# EAGLE design TrinketBlinkM0L (EAGLE 8.4.3)
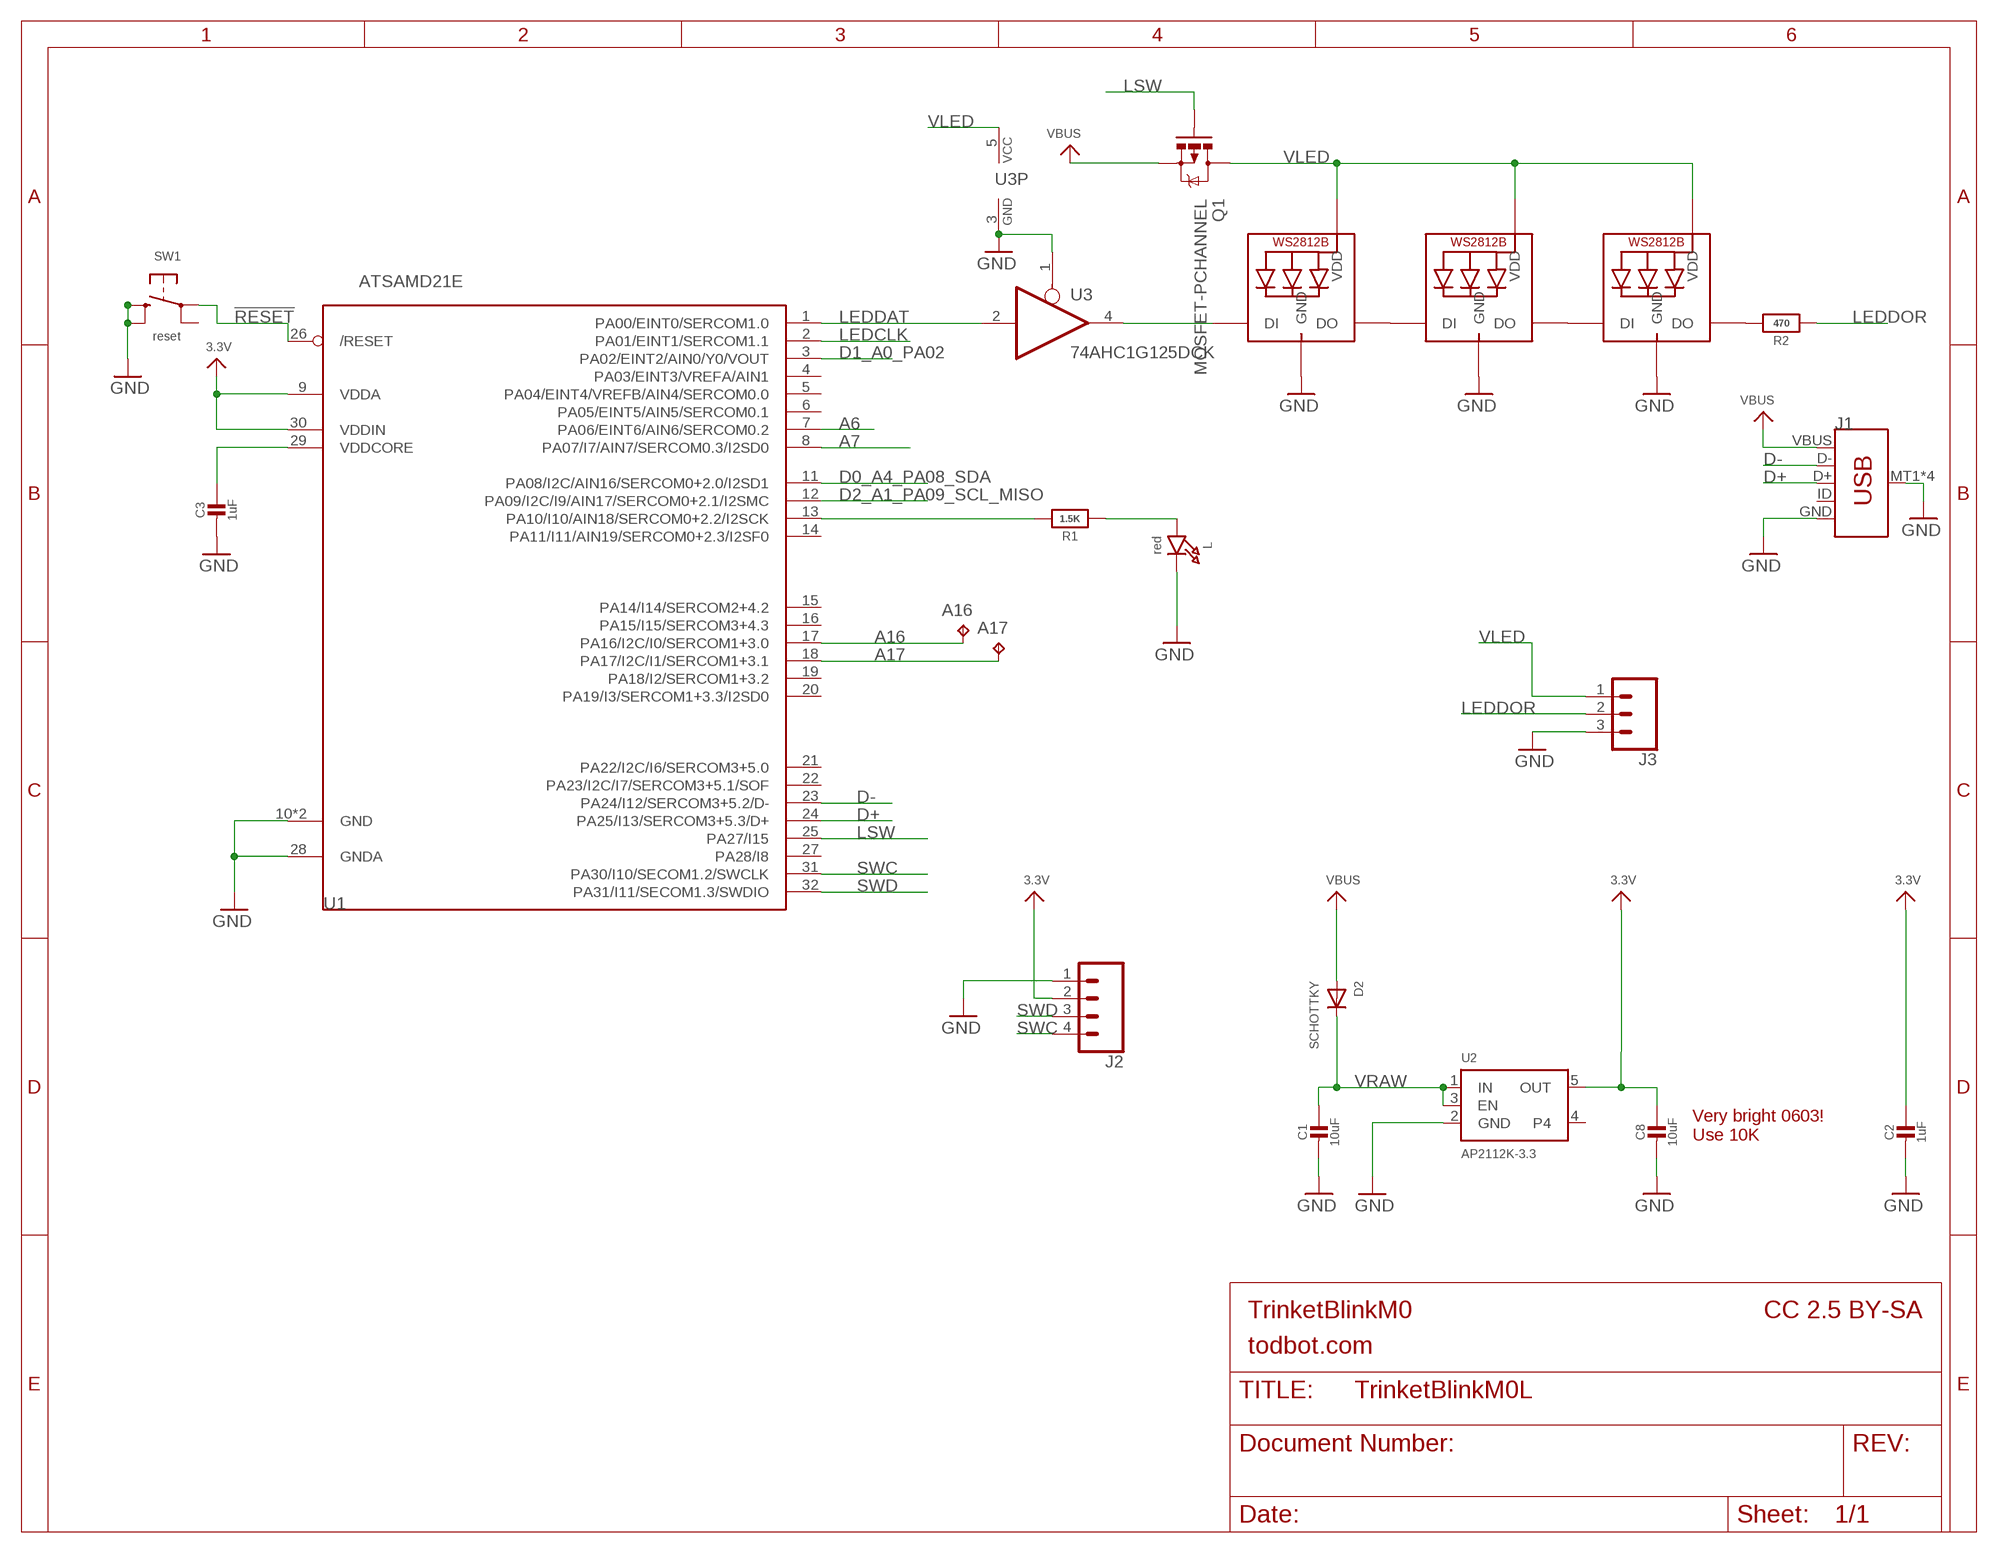
[diagram p0: schematic, sheet 1]

## Parts
A16  TPB1,27  [B1,27]
A17  TPB1,27  [B1,27]
C1  10uF  CAP_CERAMIC0805-NOOUTLINE  [0805-NO]
C2  1uF  CAP_CERAMIC0603_NO  [0603-NO]
C3  1uF  CAP_CERAMIC0603_NO  [0603-NO]
C8  10uF  CAP_CERAMIC0805-NOOUTLINE  [0805-NO]
D2  SCHOTTKY  DIODE_SOD-123FL  [SOD-123FL]
J1  USB_MICRO-B_SMT  [USB-MICROB]
J2  CONN_04  [1X04]
J3  CONN_03  [1X03]
L  red  LED0603_NOOUTLINE  [CHIPLED_0603_NOOUTLINE]
LED1  WS2812B3535  [LED3535]
LED2  WS2812B3535  [LED3535]
LED3  WS2812B3535  [LED3535]
Q1  MOSFET-PCHANNEL  [SOT23-3]
R1  1.5K  RESISTOR_0603_NOOUT  [0603-NO]
R2  470  RESISTOR_0603_NOOUT  [0603-NO]
SW1  reset  SWITCH_TACT_SMT4.6X2.8  [BTN_KMR2_4.6X2.8]
U1  ATSAMD21E  [QFN32_5MM]
U2  AP2112K-3.3  VREG_SOT23-5  [SOT23-5]
U3  74AHC1G125DCK  [SC70-5]

## Nets
3.3V: C2.1 C8.1 J2.2 U1.9(VDDA) U1.30(VDDIN) U2.5(OUT)
!RESET: SW1.A(P) U1.26(/RESET)
A6: U1.7(PA06/EINT6/AIN6/SERCOM0.2)
A7: U1.8(PA07/I7/AIN7/SERCOM0.3/I2SD0)
A16: A16.TP U1.17(PA16/I2C/I0/SERCOM1+3.0)
A17: A17.TP U1.18(PA17/I2C/I1/SERCOM1+3.1)
D0_A4_PA08_SDA: U1.11(PA08/I2C/AIN16/SERCOM0+2.0/I2SD1)
D1_A0_PA02: U1.3(PA02/EINT2/AIN0/Y0/VOUT)
D2_A1_PA09_SCL_MISO: U1.12(PA09/I2C/I9/AIN17/SERCOM0+2.1/I2SMC)
D+: J1.D+ U1.24(PA25/I13/SERCOM3+5.3/D+)
D-: J1.D- U1.23(PA24/I12/SERCOM3+5.2/D-)
GND: C1.2 C2.2 C3.2 C8.2 J1.GND J1.MT1(SHIELD) J1.MT2(SHIELD) J1.P$1(SHIELD) J1.P$2(SHIELD) J2.1 J3.3 L.C LED1.4(GND) LED2.4(GND) LED3.4(GND) SW1.B'(S1) SW1.B(S) U1.10(GND) U1.28(GNDA) U1.33(GND) U2.2(GND) U3.1(OE) U3.3(GND)
LEDCLK: U1.2(PA01/EINT1/SERCOM1.1)
LEDDAT: U1.1(PA00/EINT0/SERCOM1.0) U3.2(I)
LEDDATO: LED1.1(DI) U3.4(O)
LEDDOR: J3.2 R2.1
LSW: Q1.1(G) U1.25(PA27/I15)
N$1: L.A R1.1
N$2: R1.2 U1.13(PA10/I10/AIN18/SERCOM0+2.2/I2SCK)
N$4: LED1.3(DO) LED2.1(DI)
N$5: LED2.3(DO) LED3.1(DI)
N$6: LED3.3(DO) R2.2
SWC: J2.4 U1.31(PA30/I10/SECOM1.2/SWCLK)
SWD: J2.3 U1.32(PA31/I11/SECOM1.3/SWDIO)
VBUS: D2.A J1.VBUS Q1.2(S)
VDDCORE: C3.1 U1.29(VDDCORE)
VLED: J3.1 LED1.2(VDD) LED2.2(VDD) LED3.2(VDD) Q1.3(D) U3.5(VCC)
VRAW: C1.1 D2.C U2.1(IN) U2.3(EN)
Unconnected: J1.ID SW1.A'(P1) U1.4(PA03/EINT3/VREFA/AIN1) U1.5(PA04/EINT4/VREFB/AIN4/SERCOM0.0) U1.6(PA05/EINT5/AIN5/SERCOM0.1) U1.14(PA11/I11/AIN19/SERCOM0+2.3/I2SF0) U1.15(PA14/I14/SERCOM2+4.2) U1.16(PA15/I15/SERCOM3+4.3) U1.19(PA18/I2/SERCOM1+3.2) U1.20(PA19/I3/SERCOM1+3.3/I2SD0) U1.21(PA22/I2C/I6/SERCOM3+5.0) U1.22(PA23/I2C/I7/SERCOM3+5.1/SOF) U1.27(PA28/I8) U2.4

## Notes on the sheet
- Very bright 0603!
  Use 10K
- TrinketBlinkM0 | CC 2.5 BY-SA
- todbot.com

## Library data of the parts
A16 A17 = testpad:TP: Test pad
C1-C3 C8 = microbuilder:CAP_CERAMIC: Ceramic Capacitors For new designs, use the packages preceded by an '_' character since they are more reliable: The following footprints should be used on most boards: _0402 - Standard footprint for regular board layouts _0603 - Standard footprint for regular board layouts _0805 - Standard footprint for regular board layouts _1206 - Standard footprint for regular board layouts For extremely tight-pitch boards where space is at a premium, the following 'micro-pitch' footprints can be used (smaller pads, no silkscreen outline, etc.): _0402MP - Micro-pitch footprint for very dense/compact boards _0603MP - Micro-pitch footprint for very dense/compact boards _0805MP - Micro-pitch footprint for very dense/compact boards _1206MP - Micro-pitch footprint for very dense/compact boards
D2 = adafruit:DIODE: Diode SMADIODE - SMA Surface Mount Package 20V 1A Schottky Diode Digikey: 641-1014-6-ND DO-1N4148 - Through Hole Small Current Diode SOD-123 20V 1 A (.5mV Vf) Schottky Diode - Digikey: MBRX120TPMSCT-ND SOD-323 10V 570mA (.38mV Vf, 3ns) Schottky Diode - Digikey: ZLLS410CT-ND SOD-523 30V 30mA Schottky Diode (RB751S-40TE61) - Digikey: RB751S-40TE61CT-ND SOT23-R/W - SOT23 Package (R = Solder Paste/Reflow Ovens, W = Hand-Soldering) BAT54Film 40V 300mA - Digikey: 497-7162-1-ND
J1 = SparkFun-Connectors:USB_MICRO-B: USB Type Micro-B Connector Male/female and PTH/SMT variants SparkFun Products: SparkFun microB USB Breakout <https://www.sparkfun.com/products/12035> SparkFun USB microB Plug Breakout <https://www.sparkfun.com/products/10031> SparkFun ESP8266 Thing <https://www.sparkfun.com/products/13231>; PROD_ID: CONN-09505; SF_ID: PRT-08533
J2 = SparkFun-Connectors:CONN_04: Multi connection point. Often used as Generic Header-pin footprint for 0.1 inch spaced/style header connections On any of the 0.1 inch spaced packages, you can populate with these: Break Away Headers - Straight <https://www.sparkfun.com/products/116> (PRT-00116) Break Away Male Headers - Right Angle <https://www.sparkfun.com/products/553> (PRT-00553) Female Headers <https://www.sparkfun.com/products/115> (PRT-00115) Break Away Headers - Machine Pin <https://www.sparkfun.com/products/117> (PRT-00117) Break Away Female Headers - Swiss Machine Pin <https://www.sparkfun.com/products/743> (PRT-00743) For SCREWTERMINALS and SPRING TERMINALS visit here: Screw Terimnals on SparkFun.com <https://www.sparkfun.com/search/results?term=Screw+Terminals> (5mm/3.5mm/2.54mm spacing) This device is also useful as a general connection point to wire up your design to another part of your project. Our various solder wires solder well into these plated through hole pads. Hook-Up Wire - Assortment (Stranded, 22 AWG) <https://www.sparkfun.com/products/11375> (PRT-11375) Hook-Up Wire - Assortment (Solid Core, 22 AWG) <https://www.sparkfun.com/products/11367> (PRT-11367) View the entire wire category on our website here <https://www.sparkfun.com/categories/141> Special notes: Molex polarized connector foot print use with SKU : PRT-08231 with associated crimp pins and housings. 1MM SMD Version SKU: PRT-10208; PROD_ID: CONN-09696
J3 = SparkFun-Connectors:CONN_03: Multi connection point. Often used as Generic Header-pin footprint for 0.1 inch spaced/style header connections On any of the 0.1 inch spaced packages, you can populate with these: Break Away Headers - Straight <https://www.sparkfun.com/products/116> (PRT-00116) Break Away Male Headers - Right Angle <https://www.sparkfun.com/products/553> (PRT-00553) Female Headers <https://www.sparkfun.com/products/115> (PRT-00115) Break Away Headers - Machine Pin <https://www.sparkfun.com/products/117> (PRT-00117) Break Away Female Headers - Swiss Machine Pin <https://www.sparkfun.com/products/743> (PRT-00743) Stackable Header - 3 Pin (Female, 0.1") <https://www.sparkfun.com/products/13875> (PRT-13875) For SCREWTERMINALS and SPRING TERMINALS visit here: Screw Terimnals on SparkFun.com <https://www.sparkfun.com/search/results?term=Screw+Terminals> (5mm/3.5mm/2.54mm spacing) This device is also useful as a general connection point to wire up your design to another part of your project. Our various solder wires solder well into these plated through hole pads. Hook-Up Wire - Assortment (Stranded, 22 AWG) <https://www.sparkfun.com/products/11375> (PRT-11375) Hook-Up Wire - Assortment (Solid Core, 22 AWG) <https://www.sparkfun.com/products/11367> (PRT-11367) View the entire wire category on our website here <https://www.sparkfun.com/categories/141> Special notes: Molex polarized connector foot print use with SKU : PRT-08232 with associated crimp pins and housings.
L = microbuilder:LED: LED 0603 - 0603 Surface Mount Package 2mA: Green LED - Low Power (3.9mcd, 2ma, 1.7Vf) - Digikey: 475-2709-2-ND Orange LED - Low Power (9.8mcd, 2ma, 1.8Vf) - Digikey: 475-1194-2-ND Red LED - Low Power (5mcd, 2ma, 1.8Vf) - Digikey: 475-1195-2-ND Yellow LED - Low Power (7mcd, 2ma, 1.8Vf) - Digikey: 475-1196-2-ND 5mA: Blue LED - Low Power (17mcd, 5ma, 2.9Vf) - Digikey: LNJ937W8CRACT-ND 0805 - 0805 Surface Mount Package 2mA: Red LED (8.8mcd, 2mA, 1.8Vf, Clear) - Low Power [Digikey: 475-2510-1-ND] Green LED (5mcd, 2mA, 1.8Vf, Clear) - Low Power [Digikey: 475-2730-1-ND] Yellow LED (11.3mcd, 2mA, 1.8Vf, Clear) - Low Power [Digikey: 475-2555-1-ND] 20mA: Red LED (104mcd, 20mA, Diffused) - LS R976 [Digikey: 475-1278-6-ND] Red LED (12mcd, 20mA, 2.0Vf, Clear) - APT2012EC [Digikey: 754-1128-1-ND] Green LED (15mcd, 20mA, 2.2Vf, Clear) - APT2012GC [Digikey: 754-1131-1-ND] Orange LED (160mcd, 20mA, 2.1Vf, Clear) - APT2012SECK [Digikey: 754-1130-1-ND] 1206 - 1206 Surface Mount Package Green LED (26mcd, 20mA, Diffused) - LG N971 [Digikey: 475-1407-6-ND] Red LED (15mcd, 20mA, Diffused) - LH N974 [Digikey: 475-1416-6-ND] Cree - Cree High-Power Surface Mount LEDs XPEBWT-L1-0000-00D50 - White 111lm 350mA 2.9Vf 6200K 110° XTEAWT-00-0000-00000LEE3 - White 114lm 350mA 2.85Vf 5000K 115° Everlight - Everlight 45-21 Series Surface Mount LEDs 45-21/QK2C-B2832AC2CB2/2T - Warm White 2000mcd 20mA 3.25Vf 3050K 120° 45-21/LK2C-B38452C4CB2/2T - Nuetral White 2000mcd 20mA 3.25Vf 4150K 120° 45-21/LK2C-B50634C6CB2/2T - Cold White 2200mcd 20mA 3.25Vf 5650K 120° PLCC2 Reverse Mount LS T77K-J1L2-1-0-2-R18-Z - Red 11.25mcd 2mA 1.8Vf 630nm 120° LO T77K-L1M2-24-Z - Orange 19.6mcd 2mA 1.8Vf 606nm 120° LY T77K-K2M1-26-Z - Yellow 15.7mcd 2mA 1.8Vf 587nm 120°
LED1-LED3 = adafruit:WS2812B
Q1 = User-Submitted:MOSFET-PCHANNEL: Generic PMOSFET IRLML2244 - TRANS-11153 (SOT-23 -20V -4.3A) (1.Gate 2.Source 3.Drain) FQP27P06 - COM-10349 <http://www.sparkfun.com/products/10349> (TO-220 -60V -27A) (1.Gate 2.Source 3.Drain); PROD_ID: TRANS-08285
R1 R2 = microbuilder:RESISTOR: Resistors For new designs, use the packages preceded by an '_' character since they are more reliable: The following footprints should be used on most boards: _0402 - Standard footprint for regular board layouts _0603 - Standard footprint for regular board layouts _0805 - Standard footprint for regular board layouts _1206 - Standard footprint for regular board layouts For extremely tight-pitch boards where space is at a premium, the following 'micro-pitch' footprints can be used (smaller pads, no silkscreen outline, etc.): _0402MP - Micro-pitch footprint for very dense/compact boards _0603MP - Micro-pitch footprint for very dense/compact boards _0805MP - Micro-pitch footprint for very dense/compact boards _1206MP - Micro-pitch footprint for very dense/compact boards
SW1 = microbuilder:SWITCH_TACT_SMT: SMT Tact Switches 6x6mm - Digikey: P12940SCT-ND KMR2 (4.6x2.8mm) - Digikey: 401-1426-1-ND EVQ-PQHB55 - Light Touch, 160GF (4.5x4.5mm) - Digikey: P8090SCT-ND KMT0 - KMT021 NGJ LHS (etc.) IP68/Waterproof - Digikey: CKN10289CT-ND
U1 = microbuilder:ATSAMD21E
U2 = microbuilder:VREG_SOT23-5: SOT23-5 Fixed Voltage Regulators Part Current Out V Out V In V Dropout θJA (°C/W) TJ (°C) Digikey Part No. ADP121 150mA 3.3V 3.4-5.5V 0.09V @ 150mA -- -- ADP121-AUJZ33R7CT-ND ADP121 150mA 3.0V 3.1-5.5V 0.09V @ 150mA -- -- ADP121-AUJZ30R7CT-ND ADP122 300mA 3.3V 3.4-5.5V 0.085V @ 300mA -- -- ADP122AUJZ-3.3-R7CT-ND ADP1712 300mA 3.3V 3.5-5.5V 0.17V @ 300mA -- -- ADP1712AUJZ-3.3-R7TR-ND AP7311 (Low Cost) 150mA 3.3V 3.5-6V 0.15V @ 150mA -- -- AP7311-33WG-7DICT-ND LD39015M18R 150mA 1.8V 1.9V-5.5V 0.08V @ 100mA -- -- 497-6977-1-ND LP2985A-33DBVR 150mA 3.3V 3.3-16V 0.28V @ 150mA 206 150 296-18479-1-ND MCP1824T-3302E/OT 300mA 3.3V 3.5V-6V 0.2V @ 300mA -- -- MCP1824T-3302E/OTCT-ND MIC5205-2.5YM5 TR 150mA 2.5V 2.7-16V 0.165V @ 150mA -- -- 576-1257-2-ND MIC5205-3.0YM5 TR 150mA 3.0V 3.2V-16V 0.165V @ 150mA -- -- 576-1258-2-ND MIC5205-3.3YM5 TR 150mA 3.3V 3.5V-16V 0.165V @ 150mA -- -- 576-1259-2-ND TPS780330220 150mA 3.3V+2.2V 3.6-5.5V 250mV Max -- -- 296-23332-1-ND TDA3663/N1,135 100mA 3.3V 3.5-45V 0.18V @ 50mA -- -- 568-5343-1-ND Max operating temp can be calculated using θJA, TJ (max junction temperature), and power in watts. Set the "Maximum Ambient Temperature" until it reaches TJ ("Max Junction Temperature"), which is the absolute limit for safe use of the regulator: Heat Sink Temperature Calculator <http://www.daycounter.com/Calculators/Heat-Sink-Temperature-Calculator.phtml> For example, With 12V source into a 3.3V LP2985 and a 30mA load, we are dissipating (12V-3.3V) * 0.03A = 0.261W. With a θJA of 206 °C/W, a TJ of 150°C, and 261mW we can safely use the chip without a heat sink up to 75°C (=147.1°C Junction Temperature).
U3 = 74xx-little-us:74*1G125: Single Bus Buffer Gate with 3-State Output

## Net classes
1 power: width 0.305 mm

## Board
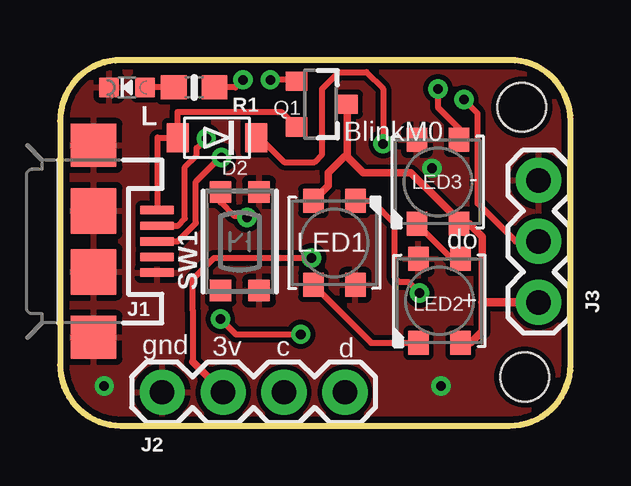
[diagram p1: board, top side]
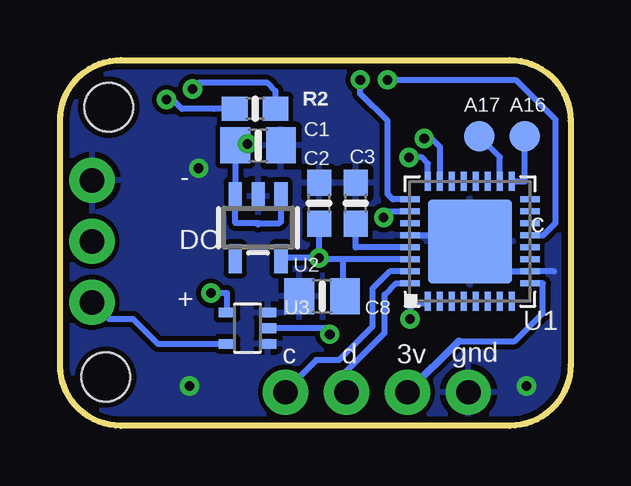
[diagram p2: board, bottom side, seen from below]

Size 21.27 x 15.24 mm. Coordinates in mm from the lower left corner, seen from the top.
Outline: 21.27,12.7 arc90 18.73,15.24 2.54,15.24 arc90 0,12.7 0,2.54 arc90 2.54,0 18.73,0 arc90 21.27,2.54 21.27,12.7
Copper layers (1*16): Top 0.035mm / dielectric 1.5mm / Bottom 0.035mm
Design rules "adafruit-2017": minimum track width 8mil, minimum drill 15.5mil, track to track 8mil, track to pad 8mil, pad to pad 8mil, via to via 8mil, smd to smd 8mil, copper to edge 10mil, drill to drill 8mil, minimum pad ring 10mil, minimum via ring 8mil, stop-mask expansion 2mil, vias tented up to drill 20mil, thermal gap 10mil
Holes 2.03 mm at 19.24,13.27 19.37,2.03

### Footprints (pad centres in the part's own frame; a part is rotated, then mirrored left to right if it is on the bottom)
B1,27 = smd 1.27 x 1.27: TP 0,0
0805-NO = smd 1.24 x 1.5: 1 -0.95,0; 2 0.95,0
0603-NO = smd 1.075 x 1: 1 -0.85,0; 2 0.85,0
SOD-123FL = smd 0.91 x 1.22: A 1.637,0; C -1.637,0
USB-MICROB = smd 1.4 x 0.35: D+ -2.65,0; D- -2.65,-0.65; GND -2.65,1.3; ID -2.65,0.65; VBUS -2.65,-1.3 | smd 1.9 x 1.8: MT1 0,-4; MT2 0,4 | smd 1.9 x 1.9: P$1 0,-1.27; P$2 0,1.27
1X04 = drill 1.016 pad 1.88: 1 0,0; 2 2.54,0; 3 5.08,0; 4 7.62,0
1X03 = drill 1.016 pad 1.88: 1 0,0; 2 2.54,0; 3 5.08,0
CHIPLED_0603_NOOUTLINE = smd 0.8 x 0.8: A 0,-0.75; C 0,0.75
LED3535 = smd 1 x 0.85: 1 -1.75,0.875; 2 -1.75,-0.875; 3 1.75,-0.875; 4 1.75,0.875
SOT23-3 = smd 0.8 x 0.9: 1 -0.95,-1; 2 0.95,-1; 3 0,1.1
BTN_KMR2_4.6X2.8 = smd 0.9 x 0.9: A 2.05,0.8; A' -2.05,0.8; B 2.05,-0.8; B' -2.05,-0.8
QFN32_5MM = smd 0.8 x 0.25: 1 -2.5,1.75; 2 -2.5,1.25; 3 -2.5,0.75; 4 -2.5,0.25; 5 -2.5,-0.25; 6 -2.5,-0.75; 7 -2.5,-1.25; 8 -2.5,-1.75; 17 2.5,-1.75; 18 2.5,-1.25; 19 2.5,-0.75; 20 2.5,-0.25; 21 2.5,0.25; 22 2.5,0.75; 23 2.5,1.25; 24 2.5,1.75 | smd 0.25 x 0.8: 9 -1.75,-2.5; 10 -1.25,-2.5; 11 -0.75,-2.5; 12 -0.25,-2.5; 13 0.25,-2.5; 14 0.75,-2.5; 15 1.25,-2.5; 16 1.75,-2.5; 25 1.75,2.5; 26 1.25,2.5; 27 0.75,2.5; 28 0.25,2.5; 29 -0.25,2.5; 30 -0.75,2.5; 31 -1.25,2.5; 32 -1.75,2.5 | smd 3.5 x 3.5: 33 0,0
SOT23-5 = smd 0.55 x 1.2: 1 -0.95,-1.3; 2 0,-1.3; 3 0.95,-1.3; 4 0.95,1.3; 5 -0.95,1.3
SC70-5 = smd 0.4 x 0.7: 1 -0.65,-0.85; 2 0,-0.85; 3 0.65,-0.85; 4 0.65,0.85; 5 -0.65,0.85

### Placement (x,y rotation side)
A16  1.91,12.07 0 bottom
A17  3.81,12.07 0 bottom
C1  13.02,11.68 0 bottom
C2  10.48,9.27 90 bottom
C3  8.95,9.27 90 bottom
C8  10.35,5.4 180 bottom
D2  6.54,12 180 top
J1  1.4,7.68 180 top
J2  4.25,1.4 0 top
J3  19.94,5.14 90 top
L  2.79,14.1 90 top
LED1  11.43,7.62 270 top
LED2  15.81,5.21 90 top
LED3  15.75,10.16 90 top
Q1  10.86,13.4 270 top
R1  5.59,14.1 0 top
R2  13.14,13.21 0 bottom
SW1  7.49,7.68 90 top
U1  4.19,7.68 90 bottom
U2  13.02,8.25 180 bottom
U3  13.46,4.06 90 bottom

### Tracks (layer width: path | path; a pad name or v marks a point on that pad's centre or on a via)
3.3V  (via drill 0.4)
  Top 0.254: 5.52,4.83 5.52,2.67 | 5.52,4.83 5.52,5.08 | 5.52,4.83 5.52,6.1 6.43,7 v10.48,7
  Top 0.305: 5.52,2.67 J2.2
  Bottom 0.254: v10.48,7 C2.1 | v10.48,7 12.07,7 U2.5 | U1.30 9.46,6.93 | 9.46,5.78 9.46,5.52 | 9.46,5.78 9.46,6.93 | C8.1 9.4,5.72 9.46,5.78 | 9.46,6.93 10.48,6.93 v10.48,7 | U1.9 1.16,5.93 1.16,4.69 2.32,3.52 4.67,3.52
  Bottom 0.305: 4.67,3.52 J2.2
!RESET  (via drill 0.4)
  Top 0.254: v7.79,8.67 7.72,8.74 7.26,8.74 6.69,9.31 SW1.A
  Bottom 0.254: U1.26 7.65,8.93 7.65,8.81 v7.79,8.67
A16
  Bottom 0.254: U1.17 1.91,10.18 A16.TP
A17
  Bottom 0.254: U1.18 2.94,11.2 A17.TP
D+  (via drill 0.4)
  Top 0.254: 6.73,11.05 v6.73,11.18 6.67,11.18 5.66,10.17 5.66,8.45 4.9,7.68 J1.D+
  Bottom 0.254: U1.24 5.94,10.92 6.2,11.18 v6.73,11.18
D-  (via drill 0.4)
  Top 0.254: J1.D- 4.9,8.33 5.21,8.64 5.21,10.77 5.69,11.26 5.69,11.57 v6.1,11.97
  Bottom 0.254: U1.23 5.44,11.62 5.79,11.97 v6.1,11.97
GND  (via drill 0.4)
  Bottom 0.254: 4.44,7.93 U1.33 | 0.7,6.43 U1.10 4,6.43 4,7.68 U1.33 | U1.28 4.19,7.93 U1.33
  other vias: 1.84,1.65 15.88,1.65 15.49,10.73
  pour Bottom: 21.4,15.43 21.4,-0.13 -0.32,-0.06 -0.32,15.49
  pour Top: -0.32,15.24 -0.32,-0.06 -0.06,-0.06 -0.06,-0.13 21.4,-0.13 21.4,15.24
LEDDAT  (via drill 0.4)
  Top 0.254: v6.68,4.45 7.33,3.81 9.46,3.81 v10.03,3.81
  Bottom 0.254: U1.1 6.04,5.08 6.6,5.08 6.68,5 v6.68,4.45 | v10.03,3.81 10.03,4.06 U3.2
LEDDATO  (via drill 0.4)
  Top 0.254: v14.99,5.52 14.51,6 14.12,6 13.93,6.19 13.93,8.45 13,9.37 LED1.1
  Bottom 0.254: U3.4 14.31,5.52 v14.99,5.52
LEDDOR  (via drill 0.4)
  Top 0.254: J3.2 18.99,7.68 17.4,9.27 17.4,13.02 v16.83,13.59
  Bottom 0.254: R2.1 14.86,13.21 | 14.86,13.21 | 14.86,13.21 16.19,13.21 16.58,13.59 v16.83,13.59
LSW  (via drill 0.4)
  Top 0.254: Q1.1 9.79,14.41 v8.76,14.41
  Bottom 0.254: U1.25 7.4,9.43 7.62,9.65 7.62,12.7 8.76,13.84 v8.76,14.41
N$1
  Top 0.254: R1.1 L.A
N$2  (via drill 0.4)
  Top 0.254: v7.62,14.41 7.3,14.1 R1.2
  Bottom 0.254: U1.13 1.15,7.93 0.64,8.45 0.64,12.76 2.29,14.41 v7.62,14.41
N$4
  Top 0.254: LED1.3 12.97,3.46 LED2.1
N$5
  Top 0.254: LED3.1 15.5,7.79 16.33,6.96 LED2.3
N$6  (via drill 0.4)
  Top 0.254: v15.75,14.04 15.75,13.27 16.62,12.4 LED3.3
  Bottom 0.254: R2.2 12.29,13.95 12.64,14.29 15.49,14.29 v15.75,14.04
SWC
  Bottom 0.254: U1.31 7.53,6.43 8.26,5.71 8.26,4.13 9.65,2.73 10.6,2.73 11.87,1.46 J2.4
SWD
  Bottom 0.254: 9.34,1.9 J2.3 9.34,2.29 7.75,3.87 7.75,5.46 7.27,5.93 U1.32
VBUS
  Top 0.254: J1.VBUS 4.06,8.98 4.06,12 D2.A 4.9,13.08 9.23,13.08 Q1.2
VDDCORE
  Bottom 0.254: C3.1 8.95,7.43 U1.29
VLED
  Top 0.254: LED1.2 10.79,9.61 | LED3.2 16.49,8.54 16.49,8.68
  Top 0.305: LED2.2 17.11,3.46 17.59,3.94 17.59,5.14 17.59,7.87 17.05,8.41 16.76,8.41 | 16.76,8.41 LED3.2 | Q1.3 11.96,11.22 | 11.96,11.22 12.64,10.54 14.61,10.54 15.18,9.97 15.2,9.97 16.49,8.68 16.76,8.41 | 11.96,11.22 11.85,11.22 11.18,10.54 11.18,9.99 LED1.2
  Top 0.356: 17.72,5.14 17.59,5.14 17.72,5.14 | 17.72,5.14 J3.1 | 11.94,13.38 Q1.3
  Bottom 0.254: U3.5 17.19,3.41 18.22,4.45 19.24,4.45 J3.1
VRAW  (via drill 0.4)
  Top 0.254: 8.26,12 D2.C 8.32,12 9.34,10.98 10.6,10.98 10.92,11.3 10.92,14.03 11.62,14.73 12.76,14.73 13.46,14.03 v13.46,11.75
  Bottom 0.254: U2.1 12.07,8.51 12.13,8.45 13.02,8.45 | 13.02,8.45 13.97,8.45 U2.3 C1.1 13.97,11.75 v13.46,11.75 | 13.02,8.38 13.02,8.45

### Text on the board
tPlace: BlinkM0 | - | do | + | gnd | 3v | c | d
bPlace: - | c | DO | + | gnd | 3v | d | c